# Altium schematic sheet DRLTransistor.SchDoc
size A4
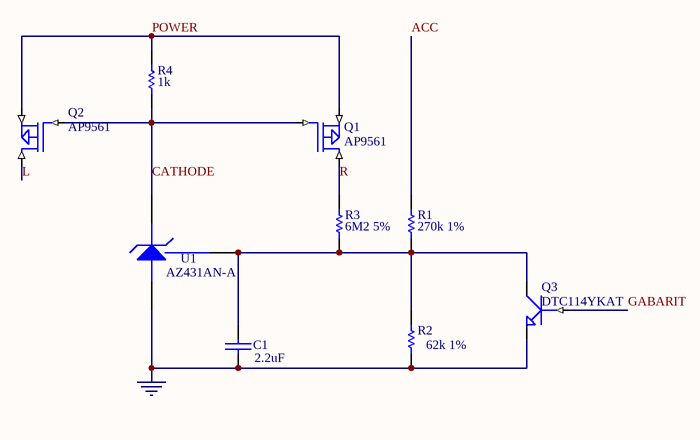
[diagram p0: DRLTransistor.SchDoc]

## Parts
C1  2.2uF  [0805]
Q1  AP9561  [D-Pack]
Q2  AP9561  [D-Pack]
Q3  DTC114YKAT  [SOT-23]
R1  270k 1%  [0805]
R2  62k 1%  [0805]
R3  6M2 5%  [0805]
R4  1k  [1206]
U1  AZ431AN-A  [SOT-23]

## Nets
PGND: C1.2 Q3.3(E) R2.2 U1.2(A)
ACC: R1.1
CATHODE: Q1.1(GATE) Q2.1(GATE) R4.2 U1.3(K)
GABARIT: Q3.1(B)
L: Q2.2(DRAIN)
POWER: Q1.3(SOURCE) Q2.3(SOURCE) R4.1
R: Q1.2(DRAIN) R3.1
NetC1_1: C1.1 Q3.2(C) R1.2 R2.1 R3.2 U1.1(REF)

## Library data of the parts
C1 = CAP: Capacitor
Q1 Q2 = MOSFET P
Q3 = NPN1: NPN Transistor
R1-R4 = Res1: Resistor; Manufacturer: Generic Components; Class: Passive; Value: 4k7; Published: 08/06/2000; Publisher: Altium Hobart Technology Centre; SubClass: Resistor
U1 = TL431